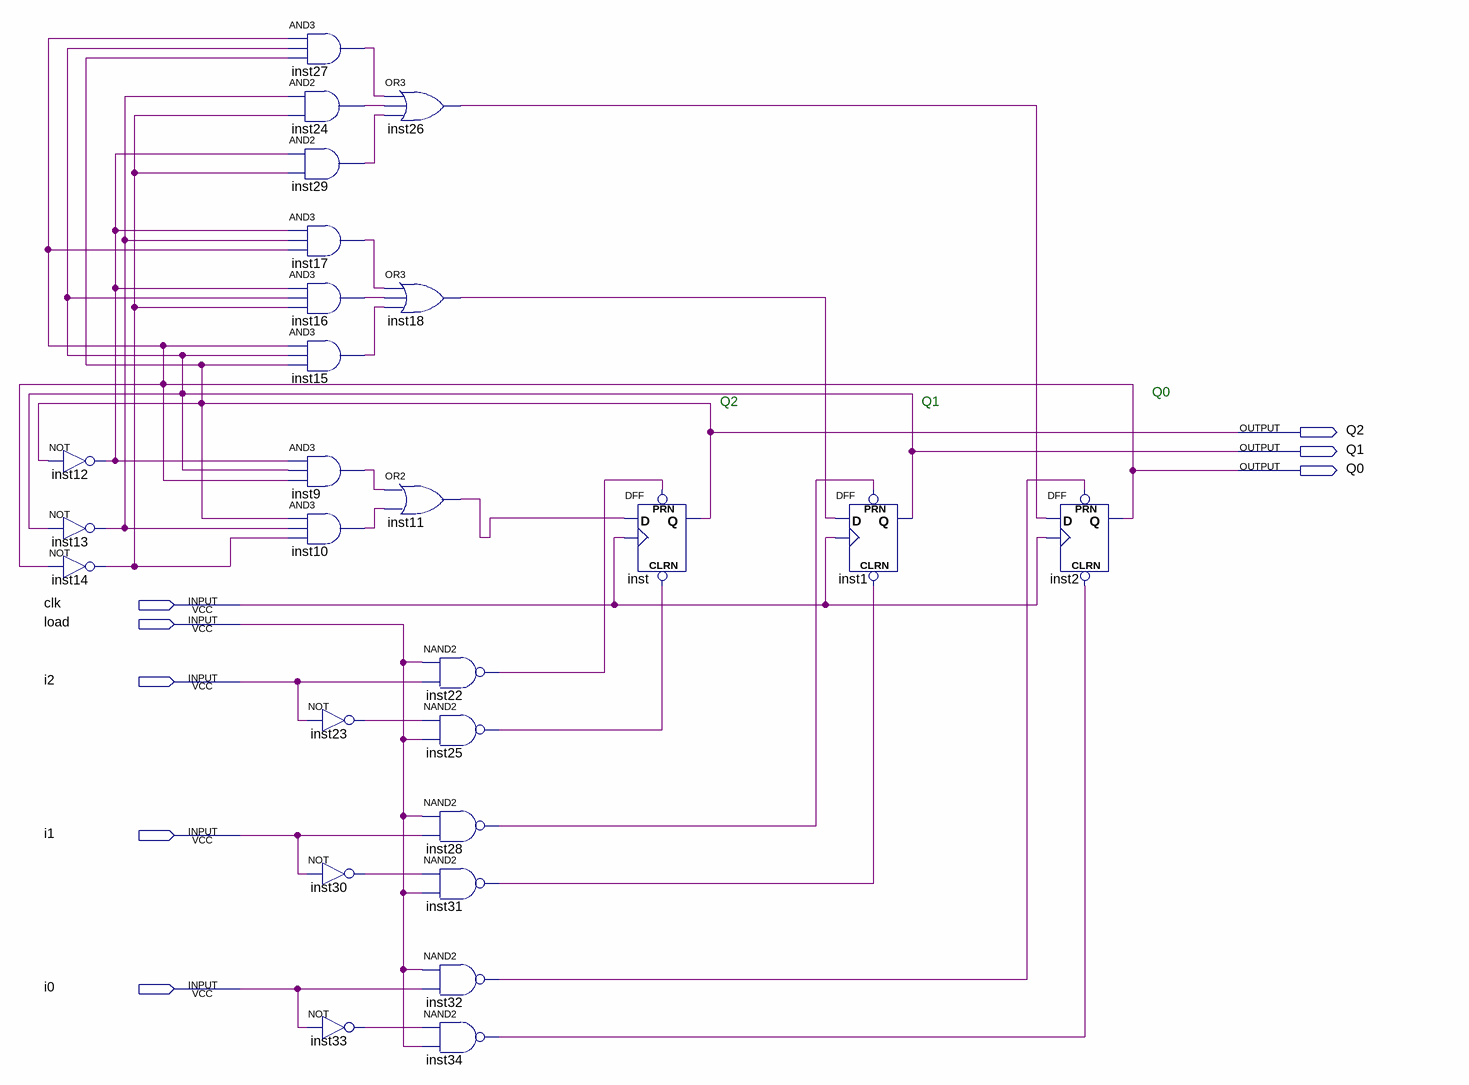
[diagram p0: schematic sheet]
// Quartus schematic counter.bdf as structural Verilog: 26 symbols, 8 pins
module counter (
  input  clk,
  input  load,
  input  i2,
  input  i1,
  input  i0,
  output Q2,
  output Q1,
  output Q0
);

  wire inst9_out, inst10_out, inst11_out, inst12_out, inst13_out, inst14_out, inst15_out, inst16_out,
       inst17_out, inst18_out, inst22_out, inst23_out, inst24_out, inst25_out, inst26_out, inst27_out,
       inst28_out, inst29_out, inst30_out, inst31_out, inst32_out, inst33_out, inst34_out;

  not inst12 (inst12_out, Q2);
  not inst13 (inst13_out, Q1);
  not inst14 (inst14_out, Q0);
  and inst27 (inst27_out, Q0, Q1, Q2);
  and inst24 (inst24_out, inst13_out, inst14_out);
  and inst29 (inst29_out, inst12_out, inst14_out);
  and inst17 (inst17_out, inst12_out, inst13_out, Q0);
  and inst16 (inst16_out, inst12_out, Q1, inst14_out);
  and inst15 (inst15_out, Q0, Q1, Q2);
  and inst9 (inst9_out, inst12_out, Q1, Q0);
  and inst10 (inst10_out, Q2, inst13_out, inst14_out);
  not inst23 (inst23_out, i2);
  not inst30 (inst30_out, i1);
  not inst33 (inst33_out, i0);
  or inst26 (inst26_out, inst27_out, inst24_out, inst29_out);
  or inst18 (inst18_out, inst17_out, inst16_out, inst15_out);
  or inst11 (inst11_out, inst9_out, inst10_out);
  nand inst22 (inst22_out, load, i2);
  nand inst25 (inst25_out, inst23_out, load);
  nand inst28 (inst28_out, load, i1);
  nand inst31 (inst31_out, inst30_out, load);
  nand inst32 (inst32_out, load, i0);
  nand inst34 (inst34_out, inst33_out, load);
  DFF inst (.CLRN(inst25_out), .CLK(clk), .D(inst11_out), .PRN(inst22_out), .Q(Q2));
  DFF inst1 (.CLRN(inst31_out), .CLK(clk), .D(inst18_out), .PRN(inst28_out), .Q(Q1));
  DFF inst2 (.CLRN(inst34_out), .CLK(clk), .D(inst26_out), .PRN(inst32_out), .Q(Q0));

  // Notes on the sheet:
  //   Q0
  //   Q2
  //   Q1
endmodule
